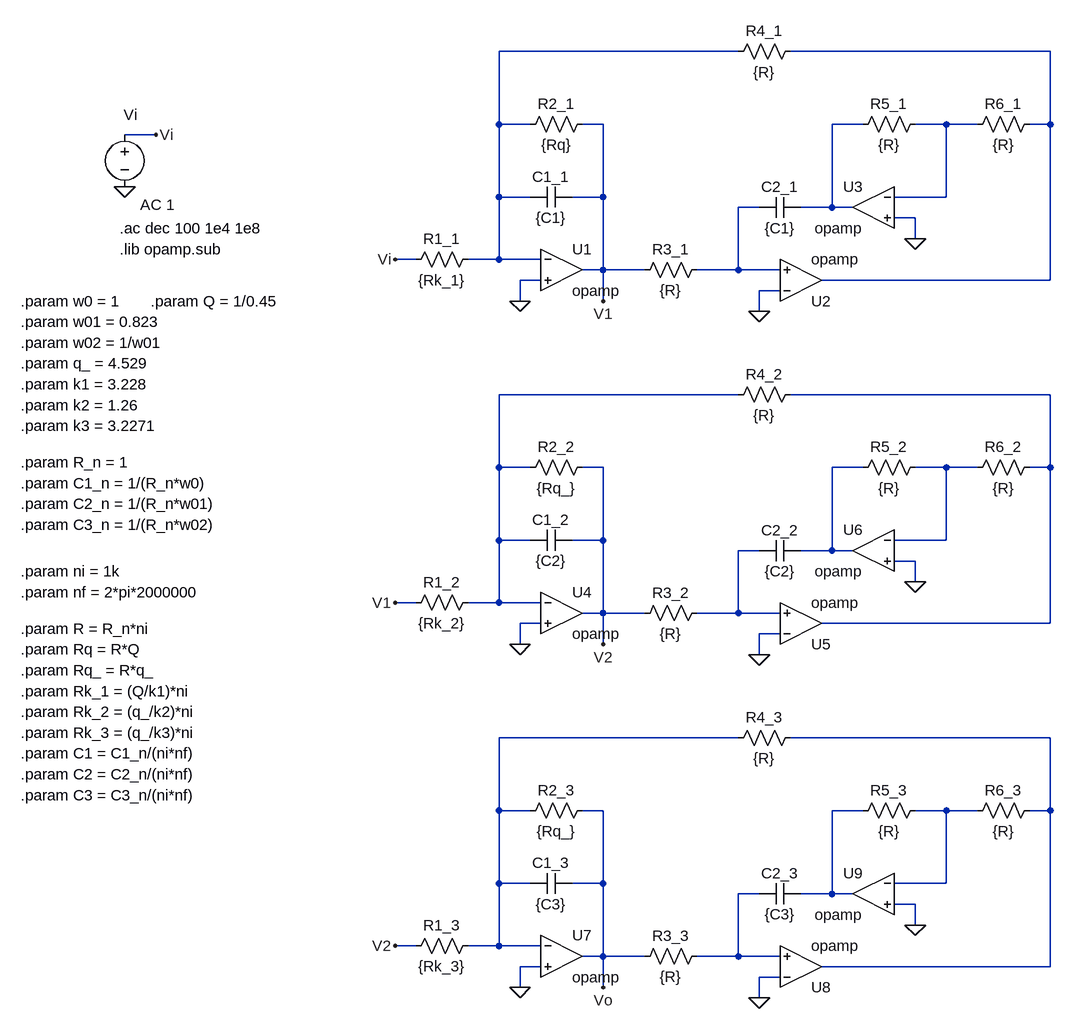
[diagram p0: schematic TPS4bis.asc]
TPS4bis.asc, the LTspice schematic file:
Version 4
SHEET 1 880 1376
WIRE 288 -176 -80 -176
WIRE 768 -176 368 -176
WIRE -80 -64 -80 -176
WIRE -32 -64 -80 -64
WIRE 80 -64 48 -64
WIRE 480 -64 432 -64
WIRE 608 -64 560 -64
WIRE 656 -64 608 -64
WIRE 768 -64 768 -176
WIRE 768 -64 736 -64
WIRE -608 -48 -656 -48
WIRE -80 48 -80 -64
WIRE -32 48 -80 48
WIRE 80 48 80 -64
WIRE 80 48 32 48
WIRE 608 48 608 -64
WIRE 608 48 528 48
WIRE 320 64 288 64
WIRE 432 64 432 -64
WIRE 432 64 384 64
WIRE 464 64 432 64
WIRE 560 80 528 80
WIRE 560 112 560 80
WIRE -208 144 -240 144
WIRE -80 144 -80 48
WIRE -80 144 -128 144
WIRE -16 144 -80 144
WIRE 80 160 80 48
WIRE 80 160 48 160
WIRE 144 160 80 160
WIRE 288 160 288 64
WIRE 288 160 224 160
WIRE 352 160 288 160
WIRE -16 176 -48 176
WIRE 768 176 768 -64
WIRE 768 176 416 176
WIRE 352 192 320 192
WIRE -48 208 -48 176
WIRE 80 208 80 160
WIRE 320 224 320 192
WIRE 288 352 -80 352
WIRE 768 352 368 352
WIRE -80 464 -80 352
WIRE -32 464 -80 464
WIRE 80 464 48 464
WIRE 480 464 432 464
WIRE 608 464 560 464
WIRE 656 464 608 464
WIRE 768 464 768 352
WIRE 768 464 736 464
WIRE -80 576 -80 464
WIRE -32 576 -80 576
WIRE 80 576 80 464
WIRE 80 576 32 576
WIRE 608 576 608 464
WIRE 608 576 528 576
WIRE 320 592 288 592
WIRE 432 592 432 464
WIRE 432 592 384 592
WIRE 464 592 432 592
WIRE 560 608 528 608
WIRE 560 640 560 608
WIRE -208 672 -240 672
WIRE -80 672 -80 576
WIRE -80 672 -128 672
WIRE -16 672 -80 672
WIRE 80 688 80 576
WIRE 80 688 48 688
WIRE 144 688 80 688
WIRE 288 688 288 592
WIRE 288 688 224 688
WIRE 352 688 288 688
WIRE -16 704 -48 704
WIRE 768 704 768 464
WIRE 768 704 416 704
WIRE 352 720 320 720
WIRE -48 736 -48 704
WIRE 80 736 80 688
WIRE 320 752 320 720
WIRE 288 880 -80 880
WIRE 768 880 368 880
WIRE -80 992 -80 880
WIRE -32 992 -80 992
WIRE 80 992 48 992
WIRE 480 992 432 992
WIRE 608 992 560 992
WIRE 656 992 608 992
WIRE 768 992 768 880
WIRE 768 992 736 992
WIRE -80 1104 -80 992
WIRE -32 1104 -80 1104
WIRE 80 1104 80 992
WIRE 80 1104 32 1104
WIRE 608 1104 608 992
WIRE 608 1104 528 1104
WIRE 320 1120 288 1120
WIRE 432 1120 432 992
WIRE 432 1120 384 1120
WIRE 464 1120 432 1120
WIRE 560 1136 528 1136
WIRE 560 1168 560 1136
WIRE -208 1200 -240 1200
WIRE -80 1200 -80 1104
WIRE -80 1200 -128 1200
WIRE -16 1200 -80 1200
WIRE 80 1216 80 1104
WIRE 80 1216 48 1216
WIRE 144 1216 80 1216
WIRE 288 1216 288 1120
WIRE 288 1216 224 1216
WIRE 352 1216 288 1216
WIRE -16 1232 -48 1232
WIRE 768 1232 768 992
WIRE 768 1232 416 1232
WIRE 352 1248 320 1248
WIRE -48 1264 -48 1232
WIRE 80 1264 80 1216
WIRE 320 1280 320 1248
FLAG -48 208 0
FLAG 320 224 0
FLAG 560 112 0
FLAG -656 32 0
FLAG -608 -48 Vi
FLAG -240 144 Vi
FLAG 80 208 V1
FLAG -48 736 0
FLAG 320 752 0
FLAG 560 640 0
FLAG -240 672 V1
FLAG 80 736 V2
FLAG -48 1264 0
FLAG 320 1280 0
FLAG 560 1168 0
FLAG -240 1200 V2
FLAG 80 1264 Vo
SYMBOL res -112 128 R90
WINDOW 0 0 56 VBottom 2
WINDOW 3 32 56 VTop 2
SYMATTR InstName R1_1
SYMATTR Value {Rk_1}
SYMBOL res 64 -80 R90
WINDOW 0 0 56 VBottom 2
WINDOW 3 32 56 VTop 2
SYMATTR InstName R2_1
SYMATTR Value {Rq}
SYMBOL cap 32 32 R90
WINDOW 0 0 32 VBottom 2
WINDOW 3 32 32 VTop 2
SYMATTR InstName C1_1
SYMATTR Value {C1}
SYMBOL Opamps\\opamp 16 96 R0
SYMATTR InstName U1
SYMATTR SpiceLine2 GBW=500Meg
SYMBOL res 240 144 R90
WINDOW 0 0 56 VBottom 2
WINDOW 3 32 56 VTop 2
SYMATTR InstName R3_1
SYMATTR Value {R}
SYMBOL cap 384 48 R90
WINDOW 0 0 32 VBottom 2
WINDOW 3 32 32 VTop 2
SYMATTR InstName C2_1
SYMATTR Value {C1}
SYMBOL Opamps\\opamp 384 240 M180
SYMATTR InstName U2
SYMATTR SpiceLine2 GBW=500Meg
SYMBOL Opamps\\opamp 496 0 M0
SYMATTR InstName U3
SYMATTR SpiceLine2 GBW=500Meg
SYMBOL res 384 -192 R90
WINDOW 0 0 56 VBottom 2
WINDOW 3 32 56 VTop 2
SYMATTR InstName R4_1
SYMATTR Value {R}
SYMBOL res 576 -80 R90
WINDOW 0 0 56 VBottom 2
WINDOW 3 32 56 VTop 2
SYMATTR InstName R5_1
SYMATTR Value {R}
SYMBOL res 752 -80 R90
WINDOW 0 0 56 VBottom 2
WINDOW 3 32 56 VTop 2
SYMATTR InstName R6_1
SYMATTR Value {R}
SYMBOL voltage -656 -64 R0
WINDOW 0 -2 -15 Left 2
WINDOW 123 24 124 Left 2
WINDOW 39 0 0 Left 2
SYMATTR InstName Vi
SYMATTR Value2 AC 1
SYMATTR Value ""
SYMBOL res -112 656 R90
WINDOW 0 0 56 VBottom 2
WINDOW 3 32 56 VTop 2
SYMATTR InstName R1_2
SYMATTR Value {Rk_2}
SYMBOL res 64 448 R90
WINDOW 0 0 56 VBottom 2
WINDOW 3 32 56 VTop 2
SYMATTR InstName R2_2
SYMATTR Value {Rq_}
SYMBOL cap 32 560 R90
WINDOW 0 0 32 VBottom 2
WINDOW 3 32 32 VTop 2
SYMATTR InstName C1_2
SYMATTR Value {C2}
SYMBOL Opamps\\opamp 16 624 R0
SYMATTR InstName U4
SYMATTR SpiceLine2 GBW=500Meg
SYMBOL res 240 672 R90
WINDOW 0 0 56 VBottom 2
WINDOW 3 32 56 VTop 2
SYMATTR InstName R3_2
SYMATTR Value {R}
SYMBOL cap 384 576 R90
WINDOW 0 0 32 VBottom 2
WINDOW 3 32 32 VTop 2
SYMATTR InstName C2_2
SYMATTR Value {C2}
SYMBOL Opamps\\opamp 384 768 M180
SYMATTR InstName U5
SYMATTR SpiceLine2 GBW=500Meg
SYMBOL Opamps\\opamp 496 528 M0
SYMATTR InstName U6
SYMATTR SpiceLine2 GBW=500Meg
SYMBOL res 384 336 R90
WINDOW 0 0 56 VBottom 2
WINDOW 3 32 56 VTop 2
SYMATTR InstName R4_2
SYMATTR Value {R}
SYMBOL res 576 448 R90
WINDOW 0 0 56 VBottom 2
WINDOW 3 32 56 VTop 2
SYMATTR InstName R5_2
SYMATTR Value {R}
SYMBOL res 752 448 R90
WINDOW 0 0 56 VBottom 2
WINDOW 3 32 56 VTop 2
SYMATTR InstName R6_2
SYMATTR Value {R}
SYMBOL res -112 1184 R90
WINDOW 0 0 56 VBottom 2
WINDOW 3 32 56 VTop 2
SYMATTR InstName R1_3
SYMATTR Value {Rk_3}
SYMBOL res 64 976 R90
WINDOW 0 0 56 VBottom 2
WINDOW 3 32 56 VTop 2
SYMATTR InstName R2_3
SYMATTR Value {Rq_}
SYMBOL cap 32 1088 R90
WINDOW 0 0 32 VBottom 2
WINDOW 3 32 32 VTop 2
SYMATTR InstName C1_3
SYMATTR Value {C3}
SYMBOL Opamps\\opamp 16 1152 R0
SYMATTR InstName U7
SYMATTR SpiceLine2 GBW=500Meg
SYMBOL res 240 1200 R90
WINDOW 0 0 56 VBottom 2
WINDOW 3 32 56 VTop 2
SYMATTR InstName R3_3
SYMATTR Value {R}
SYMBOL cap 384 1104 R90
WINDOW 0 0 32 VBottom 2
WINDOW 3 32 32 VTop 2
SYMATTR InstName C2_3
SYMATTR Value {C3}
SYMBOL Opamps\\opamp 384 1296 M180
SYMATTR InstName U8
SYMATTR SpiceLine2 GBW=500Meg
SYMBOL Opamps\\opamp 496 1056 M0
SYMATTR InstName U9
SYMATTR SpiceLine2 GBW=500Meg
SYMBOL res 384 864 R90
WINDOW 0 0 56 VBottom 2
WINDOW 3 32 56 VTop 2
SYMATTR InstName R4_3
SYMATTR Value {R}
SYMBOL res 576 976 R90
WINDOW 0 0 56 VBottom 2
WINDOW 3 32 56 VTop 2
SYMATTR InstName R5_3
SYMATTR Value {R}
SYMBOL res 752 976 R90
WINDOW 0 0 56 VBottom 2
WINDOW 3 32 56 VTop 2
SYMATTR InstName R6_3
SYMATTR Value {R}
TEXT -664 96 Left 2 !.ac dec 100 1e4 1e8
TEXT -664 128 Left 2 !.lib opamp.sub
TEXT -816 208 Left 2 !.param w0 = 1
TEXT -616 208 Left 2 !.param Q = 1/0.45
TEXT -816 240 Left 2 !.param w01 = 0.823
TEXT -816 272 Left 2 !.param w02 = 1/w01
TEXT -816 304 Left 2 !.param q_ = 4.529
TEXT -816 456 Left 2 !.param R_n = 1
TEXT -816 488 Left 2 !.param C1_n = 1/(R_n*w0)
TEXT -816 520 Left 2 !.param C2_n = 1/(R_n*w01)
TEXT -816 552 Left 2 !.param C3_n = 1/(R_n*w02)
TEXT -816 624 Left 2 !.param ni = 1k
TEXT -816 656 Left 2 !.param nf = 2*pi*2000000
TEXT -816 336 Left 2 !.param k1 = 3.228
TEXT -816 368 Left 2 !.param k2 = 1.26
TEXT -816 400 Left 2 !.param k3 = 3.2271
TEXT -816 712 Left 2 !.param R = R_n*ni
TEXT -816 904 Left 2 !.param C1 = C1_n/(ni*nf)
TEXT -816 744 Left 2 !.param Rq = R*Q
TEXT -816 776 Left 2 !.param Rq_ = R*q_
TEXT -816 808 Left 2 !.param Rk_1 = (Q/k1)*ni
TEXT -816 840 Left 2 !.param Rk_2 = (q_/k2)*ni
TEXT -816 872 Left 2 !.param Rk_3 = (q_/k3)*ni
TEXT -816 936 Left 2 !.param C2 = C2_n/(ni*nf)
TEXT -816 968 Left 2 !.param C3 = C3_n/(ni*nf)

The netlist it stands for:
* TPS4bis.asc
R1_1 N001 Vi {Rk_1}
R2_1 V1 N001 {Rq}
C1_1 V1 N001 {C1}
XU1 N001 0 V1 opamp Aol=100K GBW=500Meg  ; pins invin noninvin out
R3_1 N005 V1 {R}
C2_1 N003 N005 {C1}
XU2 0 N005 N002 opamp Aol=100K GBW=500Meg  ; pins invin noninvin out
XU3 N004 0 N003 opamp Aol=100K GBW=500Meg  ; pins invin noninvin out
R4_1 N002 N001 {R}
R5_1 N004 N003 {R}
R6_1 N002 N004 {R}
Vi Vi 0 AC 1
R1_2 N006 V1 {Rk_2}
R2_2 V2 N006 {Rq_}
C1_2 V2 N006 {C2}
XU4 N006 0 V2 opamp Aol=100K GBW=500Meg  ; pins invin noninvin out
R3_2 N010 V2 {R}
C2_2 N008 N010 {C2}
XU5 0 N010 N007 opamp Aol=100K GBW=500Meg  ; pins invin noninvin out
XU6 N009 0 N008 opamp Aol=100K GBW=500Meg  ; pins invin noninvin out
R4_2 N007 N006 {R}
R5_2 N009 N008 {R}
R6_2 N007 N009 {R}
R1_3 N011 V2 {Rk_3}
R2_3 Vo N011 {Rq_}
C1_3 Vo N011 {C3}
XU7 N011 0 Vo opamp Aol=100K GBW=500Meg  ; pins invin noninvin out
R3_3 N015 Vo {R}
C2_3 N013 N015 {C3}
XU8 0 N015 N012 opamp Aol=100K GBW=500Meg  ; pins invin noninvin out
XU9 N014 0 N013 opamp Aol=100K GBW=500Meg  ; pins invin noninvin out
R4_3 N012 N011 {R}
R5_3 N014 N013 {R}
R6_3 N012 N014 {R}
.ac dec 100 1e4 1e8
.lib opamp.sub
.param w0 = 1
.param Q = 1/0.45
.param w01 = 0.823
.param w02 = 1/w01
.param q_ = 4.529
.param R_n = 1
.param C1_n = 1/(R_n*w0)
.param C2_n = 1/(R_n*w01)
.param C3_n = 1/(R_n*w02)
.param ni = 1k
.param nf = 2*pi*2000000
.param k1 = 3.228
.param k2 = 1.26
.param k3 = 3.2271
.param R = R_n*ni
.param C1 = C1_n/(ni*nf)
.param Rq = R*Q
.param Rq_ = R*q_
.param Rk_1 = (Q/k1)*ni
.param Rk_2 = (q_/k2)*ni
.param Rk_3 = (q_/k3)*ni
.param C2 = C2_n/(ni*nf)
.param C3 = C3_n/(ni*nf)
.backanno
.end